# Altium project FIT_PM12_v1.1.PrjPcb (part 11 of 13)

## Sheet Gate_Strobe.SchDoc: FIT_PM12 board
size 420 x 297 mm; CheckedBy: G.Kasprowicz; Author: INR Moscow; CompanyName: WUT ISE; DrawnBy: M.Podgórski; Organization: WUT ISE; Address1: PW ISE; Address2: Nowowiejska 15/19 00-665 Warsaw; Address3: gkasprow@gmail.com; DocumentNumber: 5; Revision: 2; SheetNumber: 12; SheetTotal: 34; ModifiedBy: -; CheckedDate: -; Title2: INT gate strobe; DivGrp: WUT ISE; Designer: INR RAS; ModifiedDate: -; ProjectName: Sensor Box
Used 12 times, as channels AFE/Gate_Strobe1, AFE/Gate_Strobe2, AFE/Gate_Strobe3, AFE/Gate_Strobe4, AFE/Gate_Strobe5, AFE/Gate_Strobe6, AFE/Gate_Strobe7, AFE/Gate_Strobe8, AFE/Gate_Strobe9, AFE/Gate_Strobe10, AFE/Gate_Strobe11, AFE/Gate_Strobe12. Parts and nets are listed once, with the designators drawn on the sheet.
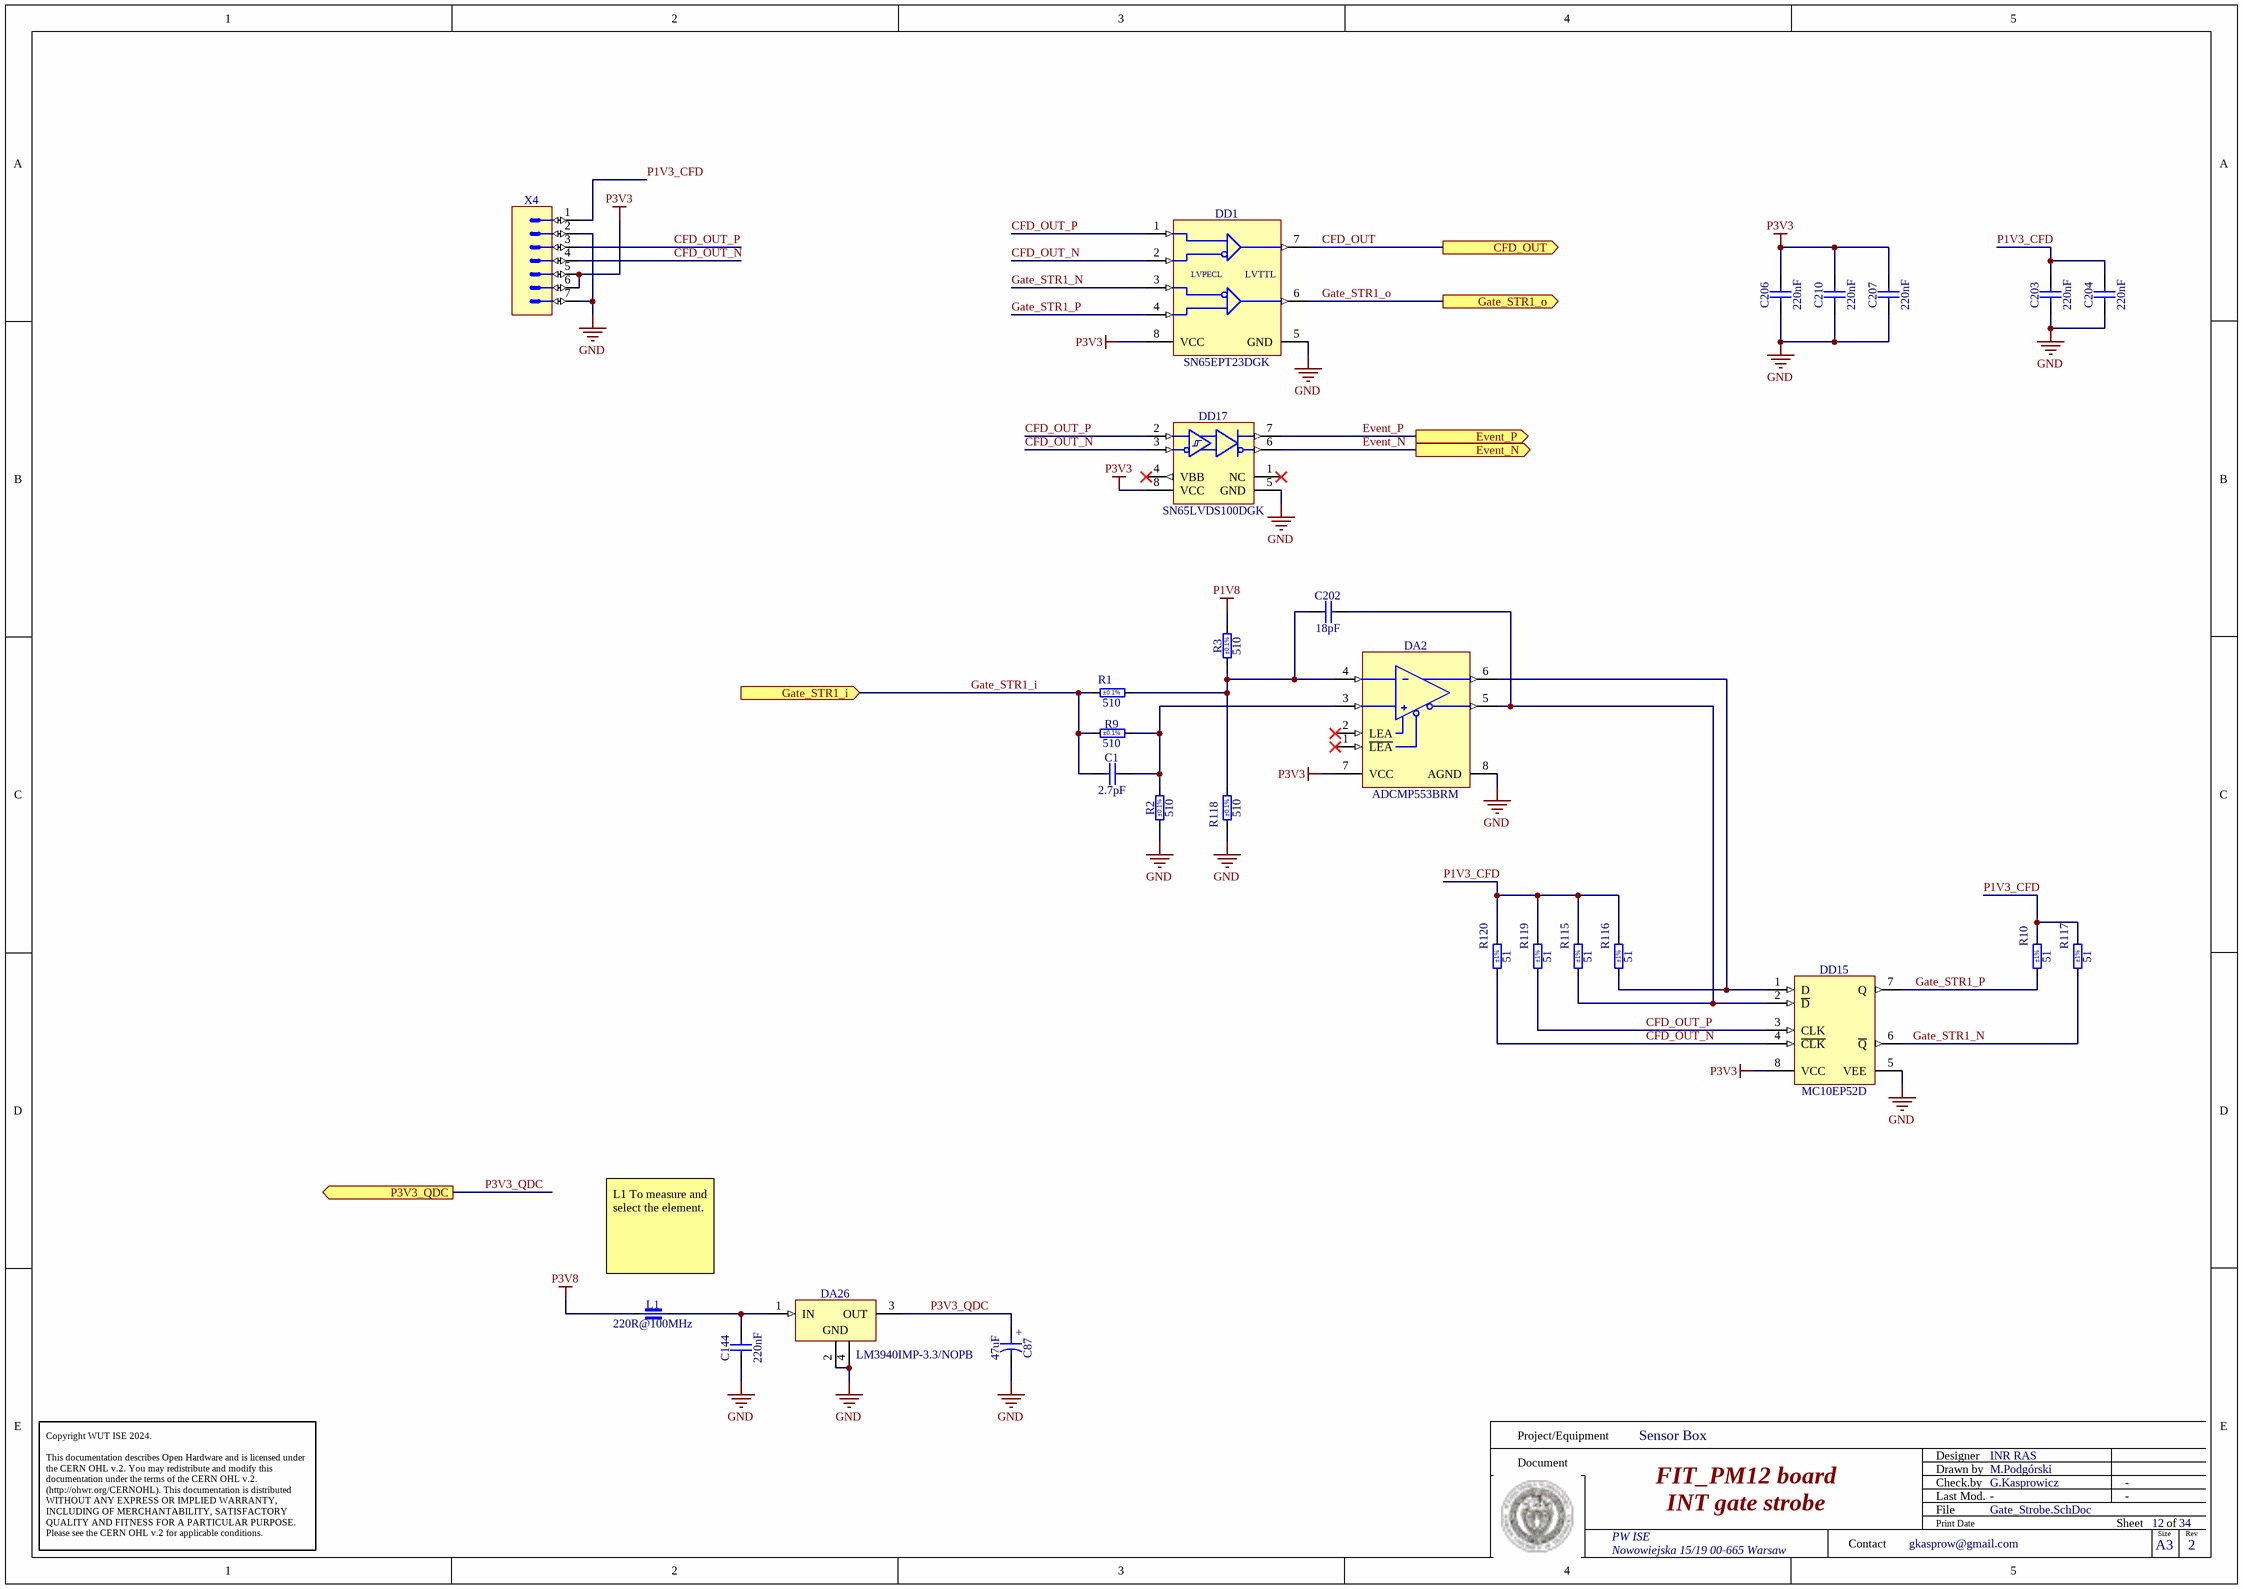
[diagram p33: Gate_Strobe.SchDoc]

### Parts
C1  2.7pF  [CAPC2012X135N]
C87  47uF  [CAPAE530X610N]
C144  220nF  [CAPC2012X135N]
C202  18pF  [CAPC2012X88N]
C203  220nF  [CAPC2012X135N]
C204  220nF  [CAPC2012X135N]
C206  220nF  [CAPC2012X135N]
C207  220nF  [CAPC2012X135N]
C210  220nF  [CAPC2012X135N]
DA2  ADCMP553BRM  [SOP65P490X110-8N]
DA26  LM3940IMP-3.3/NOPB  [SOT230P700X180-4N]
DD1  SN65EPT23DGK  [SOP65P490X110-8N]
DD15  MC10EP52D  [SOIC127P600X175-8N]
DD17  SN65LVDS100DGK  [SOP65P490X110-8N]
L1  220R@100MHz  [INDC2012X105N]
R1  510  Tolerance: ±0.1%  [RESC2012X60N]
R2  510  Tolerance: ±0.1%  [RESC2012X60N]
R3  510  Tolerance: ±0.1%  [RESC2012X60N]
R9  510  Tolerance: ±0.1%  [RESC2012X60N]
R10  51  Tolerance: ±1%  [RESC2012X60N]
R115  51  Tolerance: ±1%  [RESC2012X60N]
R116  51  Tolerance: ±1%  [RESC2012X60N]
R117  51  Tolerance: ±1%  [RESC2012X60N]
R118  510  Tolerance: ±0.1%  [RESC2012X60N]
R119  51  Tolerance: ±1%  [RESC2012X60N]
R120  51  Tolerance: ±1%  [RESC2012X60N]
X4  Header 7  [SAMTEC_DW-07-09-L-S-470]  (value not drawn)

### Ports
CFD_OUT (out), Event_N (out), Event_P (out), Gate_STR1_i (in), Gate_STR1_o (out), P3V3_QDC (out)

### Nets
GND: C87.2 C144.1 C203.1 C204.1 C206.1 C207.1 C210.1 DA2.8(AGND) DA26.2(GND) DA26.4(GND) DD1.5(GND) DD15.5(VEE) DD17.5(GND) R2.1 R118.1 X4.2 X4.7
P1V8: R3.2
P3V3: C206.2 C207.2 C210.2 DA2.7(VCC) DD1.8(VCC) DD15.8(VCC) DD17.8(VCC) X4.5 X4.6
P3V8: L1.1
CFD_OUT: DD1.7(Q0) ; port CFD_OUT
CFD_OUT_N: DD1.2(~{D0}) DD15.4(~{CLK}) DD17.3(B) R120.1 X4.4
CFD_OUT_P: DD1.1(D0) DD15.3(CLK) DD17.2(A) R119.1 X4.3
Event_N: DD17.6(Z) ; port Event_N
Event_P: DD17.7(Y) ; port Event_P
Gate_STR1_i: C1.1 R1.1 R9.1 ; port Gate_STR1_i
Gate_STR1_N: DD1.3(~{D1}) DD15.6(~{Q}) R117.1
Gate_STR1_o: DD1.6(Q1) ; port Gate_STR1_o
Gate_STR1_P: DD1.4(D1) DD15.7(Q) R10.1
P1V3_CFD: C203.2 C204.2 R10.2 R115.2 R116.2 R117.2 R119.2 R120.2 X4.1
P3V3_QDC: C87.1 DA26.3(OUT) ; port P3V3_QDC
NetC1_2: C1.2 DA2.3(+INA) R2.2 R9.2
NetC144_2: C144.2 DA26.1(IN) L1.2
NetC202_1: C202.1 DA2.4(-INA) R1.2 R3.1 R118.2
NetC202_2: C202.2 DA2.5(~{QA}) DD15.2(~{D}) R115.1
NetDA2_6: DA2.6(QA) DD15.1(D) R116.1

Not connected (* = marked no-connect by the designer): DA2 1(~{LEA})* 2(LEA)*; DD17 1(NC)* 4(VBB)*

### Channels
AFE/Gate_Strobe1: designators end in A; ports CFD_OUT=CFD_OUT Event_N=Event_N Event_P=Event_P Gate_STR1_i=Gate_STR1_i Gate_STR1_o=Gate_STR1_o P3V3_QDC=P3V3_QDC
AFE/Gate_Strobe2: designators end in B; ports CFD_OUT=CFD_OUT Event_N=Event_N Event_P=Event_P Gate_STR1_i=Gate_STR1_i Gate_STR1_o=Gate_STR1_o P3V3_QDC=P3V3_QDC
AFE/Gate_Strobe3: designators end in C; ports CFD_OUT=CFD_OUT Event_N=Event_N Event_P=Event_P Gate_STR1_i=Gate_STR1_i Gate_STR1_o=Gate_STR1_o P3V3_QDC=P3V3_QDC
AFE/Gate_Strobe4: designators end in D; ports CFD_OUT=CFD_OUT Event_N=Event_N Event_P=Event_P Gate_STR1_i=Gate_STR1_i Gate_STR1_o=Gate_STR1_o P3V3_QDC=P3V3_QDC
AFE/Gate_Strobe5: designators end in E; ports CFD_OUT=CFD_OUT Event_N=Event_N Event_P=Event_P Gate_STR1_i=Gate_STR1_i Gate_STR1_o=Gate_STR1_o P3V3_QDC=P3V3_QDC
AFE/Gate_Strobe6: designators end in F; ports CFD_OUT=CFD_OUT Event_N=Event_N Event_P=Event_P Gate_STR1_i=Gate_STR1_i Gate_STR1_o=Gate_STR1_o P3V3_QDC=P3V3_QDC
AFE/Gate_Strobe7: designators end in G; ports CFD_OUT=CFD_OUT Event_N=Event_N Event_P=Event_P Gate_STR1_i=Gate_STR1_i Gate_STR1_o=Gate_STR1_o P3V3_QDC=P3V3_QDC
AFE/Gate_Strobe8: designators end in H; ports CFD_OUT=CFD_OUT Event_N=Event_N Event_P=Event_P Gate_STR1_i=Gate_STR1_i Gate_STR1_o=Gate_STR1_o P3V3_QDC=P3V3_QDC
AFE/Gate_Strobe9: designators end in I; ports CFD_OUT=CFD_OUT Event_N=Event_N Event_P=Event_P Gate_STR1_i=Gate_STR1_i Gate_STR1_o=Gate_STR1_o P3V3_QDC=P3V3_QDC
AFE/Gate_Strobe10: designators end in J; ports CFD_OUT=CFD_OUT Event_N=Event_N Event_P=Event_P Gate_STR1_i=Gate_STR1_i Gate_STR1_o=Gate_STR1_o P3V3_QDC=P3V3_QDC
AFE/Gate_Strobe11: designators end in K; ports CFD_OUT=CFD_OUT Event_N=Event_N Event_P=Event_P Gate_STR1_i=Gate_STR1_i Gate_STR1_o=Gate_STR1_o P3V3_QDC=P3V3_QDC
AFE/Gate_Strobe12: designators end in L; ports CFD_OUT=CFD_OUT Event_N=Event_N Event_P=Event_P Gate_STR1_i=Gate_STR1_i Gate_STR1_o=Gate_STR1_o P3V3_QDC=P3V3_QDC

### Notes on the sheet
- (near L1) L1 To measure and select the element.
- Project/Equipment
- Document
- Designer
- Drawn by
- Check.by
- Copyright WUT ISE 2024.
  This documentation describes Open Hardware and is licensed under the CERN OHL v.2. You may redistribute and modify this documentation under the terms of the CERN OHL v.2. (http://ohwr.org/CERNOHL). This documentation is distributed WITHOUT ANY EXPRESS OR IMPLIED WARRANTY, INCLUDING OF MERCHANTABILITY, SATISFACTORY QUALITY AND FITNESS FOR A PARTICULAR PURPOSE. Please see the CERN OHL v.2 for applicable conditions.
- Contact
- File
- Last Mod.
- Print Date
- Sheet
- Size
- A3
- of
- Rev
- (in symbol CAE530-610_47UF_16V_20%) +
- (in symbol SN65EPT23DGK) LVPECL; LVTTL

### Library data of the parts
C1 = CC0805_2.7PF_250V_0.05PF_NP0: Non-polarised capacitor; Part Description: SMD Multilayer Chip Ceramic Capacitor; Manufacturer: GENERIC; Manufacturer1 Part Number: 600F2R7AT250XT; Voltage: 50V; TC: C0G/NP0; Tolerance: ±0.05pF; Part Number: CC0805_2.7PF_250V_0.05PF_NP0; Component Kind: Standard; Component Type: Standard; Pin Count: 2; Value: 2.7pF; Status: None; Manufacturer Part Number: CC0805_2.7PF_250V_0.05PF_NP0; Case: 0805; Mounted: Yes; Socket: No; SMD: Yes; Sense: No; Manufacturer1 Example: AVX; Manufacturer1 ComponentHeight: 1.30mm; HelpURL: \\cern.ch\dfs\Applications\Altium\Datasheets\CC0805_NP0_AVX(MLC).pdf; Author: CERN DEM HF; CreateDate: 07.05.2024; LatestRevisionDate: 07.05.2024
C87 = CAE530-610_47UF_16V_20%: Polarised capacitor; Part Description: Conductive Polymer Hybrid Aluminum Electrolytic Capacitor; Manufacturer: CHEMI-CON; Manufacturer Part Number: HHXD160ARA470ME61G; Voltage: 16V; Tolerance: ±20%; Part Number: CAE530-610_47UF_16V_20%; Component Kind: Standard; Component Type: Standard; Pin Count: 2; Value: 47uF; Status: Not Recommended; Case: C; Mounted: Yes; Socket: No; SMD: Yes; Sense: No; ComponentHeight: 6.1mm; HelpURL: \\cern.ch\dfs\Applications\Altium\Datasheets\CAE_CHIMI-CON_HXD.pdf; Author: CERN DEM HF; CreateDate: 15.04.2024; LatestRevisionDate: 15.04.2024
C144 C203 C204 C206 C207 C210 = CC0805_220NF_50V_10%_X7R: as C68 on sheet XC2C128; Part Number: CC0805_220NF_50V_10%_X7R; Component Kind: Standard; Component Type: Standard; Pin Count: 2; Value: 220nF; Status: Preferred; Manufacturer Part Number: CC0805_220NF_50V_10%_X7R; Case: 0805; Mounted: Yes; Socket: No; SMD: Yes; Sense: No; Manufacturer1 Example: MURATA; Manufacturer1 ComponentHeight: 1.35mm; HelpURL: \\cern.ch\dfs\Applications\Altium\Datasheets\CC0805_X7R_MURATA.pdf; Author: CERN DEM JLC; CreateDate: 03.12.2007; LatestRevisionDate: 03.12.2007
C202 = CC0805_18PF_50V_1%_C0G: Non-polarised capacitor; Part Description: SMD Multilayer Chip Ceramic Capacitor; Manufacturer: GENERIC; Manufacturer1 Part Number: C0805C180F5GACTU; Voltage: 50V; TC: C0G/NP0; Tolerance: ±1%; Part Number: CC0805_18PF_50V_1%_C0G; Component Kind: Standard; Component Type: Standard; Pin Count: 2; Value: 18pF; Status: None; Manufacturer Part Number: CC0805_18PF_50V_1%_C0G; Case: 0805; Mounted: Yes; Socket: No; SMD: Yes; Sense: No; Manufacturer1 Example: KEMET; Manufacturer1 ComponentHeight: 0.88mm; HelpURL: \\cern.ch\dfs\Applications\Altium\Datasheets\CC0805_C0G_KEMET_(Commercial Grade).pdf; Author: CERN DEM JLC; CreateDate: 27.01.2015; LatestRevisionDate: 27.01.2015
DA2 = ADCMP553BRM: Single-Supply, High Speed PECL/LVPECL Comparators; Part Description: Single-Supply, High Speed, PECL/LVPECL Comparators; Manufacturer: ANALOG DEVICES; PressFit: No; Bonding: No; Part Number: ADCMP553BRM; Component Kind: Standard; Component Type: Standard; Device: ADCMP553BRM; PackageDescription: SOP, 0.65mm Pitch; 8 Pin, 3.00mm W X 3.00mm L X 1.10mm H body, IPC Medium Density; Manufacturer Part Number: ADCMP553BRM; Pin Count: 8; Case: MSOP8; Mounted: Yes; Socket: No; SMD: Yes; Sense: No; ComponentHeight: 1.1mm; Author: CERN DEM HF; HelpURL: \\cern.ch\dfs\Applications\Altium\Datasheets\ADCMP553.pdf; CreateDate: 06.05.2024; LatestRevisionDate: 06.05.2024
DA26 = LM3940IMP-3.3/NOPB: 3-Terminal Regulator 1=IN 2=GND 3=OUT 4=GND; Part Description: 1A Low Dropout Regulator for 5V to 3.3V Conversion; Manufacturer: TEXAS INSTRUMENTS; PressFit: No; Bonding: No; Part Number: LM3940IMP-3.3/NOPB; Component Kind: Standard; Component Type: Standard; Device: LM3940IMP-3.3/NOPB; PackageDescription: SOT223, 2.30mm Pitch; 4 Pin, 3.70mm W X 6.70mm L X 1.80mm H body, IPC Medium Density; Manufacturer Part Number: LM3940IMP-3.3; Pin Count: 4; Case: SOT223; Mounted: Yes; Socket: No; SMD: Yes; Sense: No; ComponentHeight: 1.8mm; HelpURL: \\cern.ch\dfs\Applications\Altium\Datasheets\LM3940IMP-3.3-NOPB.pdf; Author: CERN DEM JLC; CreateDate: 28.03.2011; LatestRevisionDate: 01.06.2022
DD1 = SN65EPT23DGK: 5V PECL to TTL Translator; Part Description: 3.3V ECL Differential LVPECL/LVDS to LVTTL/LVCMOS Translator; Manufacturer: TEXAS INSTRUMENTS; PressFit: No; Bonding: No; Part Number: SN65EPT23DGK; Component Kind: Standard; Component Type: Standard; Device: SN65EPT23DGK; PackageDescription: SOP, 0.65mm Pitch; 8 Pin, 3.00mm W X 3.00mm L X 1.10mm H body, IPC Medium Density; Manufacturer Part Number: SN65EPT23DGK; Pin Count: 8; Case: TSSOP8; Mounted: Yes; Socket: No; SMD: Yes; Sense: No; ComponentHeight: 1.1mm; Author: CERN DEM HF; HelpURL: \\cern.ch\dfs\Applications\Altium\Datasheets\SN65EPT23.pdf; CreateDate: 17.05.2024; LatestRevisionDate: 17.05.2024
DD15 = MC10EP52D: 3.3V/5V ECL Differential Data and Clock D Flip-Flop; Manufacturer: ON SEMICONDUCTOR; PressFit: No; Bonding: No; Part Number: MC10EP52D; Component Kind: Standard; Component Type: Standard; Device: MC10EP52D; PackageDescription: SOIC 8, Pitch 1.27mm - Body 4x5mm, IPC Medium Density; Part Description: 3.3V/5V ECL Differential Data and Clock D Flip-Flop; Manufacturer Part Number: MC10EP52D; Pin Count: 8; Case: SOIC8; Mounted: Yes; Socket: No; SMD: Yes; Sense: No; ComponentHeight: 1.75mm; Author: CERN DEM HF; HelpURL: \\cern.ch\dfs\Applications\Altium\Datasheets\MC10EP52D.pdf; CreateDate: 08.05.2024; LatestRevisionDate: 08.05.2024
DD17 = SN65LVDS100DGK: Differential LVDS Translator/Repeater; Part Description: 2Gbps Differential LVDS Translator/Repeater; Manufacturer: TEXAS INSTRUMENTS; PressFit: No; Bonding: No; Part Number: SN65LVDS100DGK; Component Kind: Standard; Component Type: Standard; Device: SN65LVDS100DGK; PackageDescription: SOP, 0.65mm Pitch; 8 Pin, 3.00mm W X 3.00mm L X 1.10mm H body, IPC Medium Density; Manufacturer Part Number: SN65LVDS100DGK; Pin Count: 8; Case: SSOP8; Mounted: Yes; Socket: No; SMD: Yes; Sense: No; ComponentHeight: 1.1mm; Author: CERN DEM JLC; HelpURL: \\cern.ch\dfs\Applications\Altium\Datasheets\SN65LVDS100DGK.pdf; CreateDate: 18.11.2011; LatestRevisionDate: 18.11.2011
L1 = IND0805_TDK_MPZ2012S221A: Part Description: SMT Chip Bead for General Power Line (MPZ Series); Manufacturer: TDK; Power: 3A; Resistance: 0.04R; Tolerance: ±25%; Part Number: IND0805_TDK_MPZ2012S221A; Component Kind: Standard; Component Type: Standard; Pin Count: 2; Value: 220R@100MHz; Manufacturer Part Number: MPZ2012S221A; Case: 0805; Mounted: Yes; Socket: No; SMD: Yes; Sense: No; ComponentHeight: 1.05mm; HelpURL: \\cern.ch\dfs\Applications\Altium\Datasheets\IND0805_TDK_MPZ2012.pdf; Author: CERN DEM HF; CreateDate: 04.10.2021; LatestRevisionDate: 04.10.2021
R1-R3 R9 R118 = R0805_510R_0.1%_0.125W_10PPM: Resistor - 0.1%; Part Description: Thin Film Chip Resistor; Manufacturer: GENERIC; Manufacturer1 Part Number: RT0805BRB07510RL; Power: 0.125W; TC: ±10ppm; PressFit: No; Part Number: R0805_510R_0.1%_0.125W_10PPM; Component Kind: Standard; Component Type: Standard; Pin Count: 2; Value: 510; Status: Not Recommended; Manufacturer Part Number: R0805_510R_0.1%_0.125W_10PPM; Case: 0805; Mounted: Yes; Sense: No; Socket: No; SMD: Yes; Manufacturer1 Example: YAGEO PHYCOMP; Manufacturer1 ComponentHeight: 0.6mm; HelpURL: \\cern.ch\dfs\Applications\Altium\Datasheets\R0805_YAGEO_RT.pdf; Author: CERN DEM HF; CreateDate: 11.07.2022; LatestRevisionDate: 11.07.2022
R10 R115-R117 R119 R120 = R0805_51R_1%_0.125W_100PPM: Resistor - 1%; Part Description: General Purpose Thick Film Chip Resistor; Manufacturer: GENERIC; Manufacturer1 Part Number: NRC10F51R0TRF; Power: 0.125W; TC: ±100ppm/°C; PressFit: No; Part Number: R0805_51R_1%_0.125W_100PPM; Component Kind: Standard; Component Type: Standard; Pin Count: 2; Value: 51; Status: Preferred; Manufacturer Part Number: R0805_51R_1%_0.125W_100PPM; Case: 0805; Mounted: Yes; Sense: No; Socket: No; SMD: Yes; Manufacturer1 Example: NIC COMPONENT; Manufacturer1 ComponentHeight: 0.6mm; HelpURL: \\cern.ch\dfs\Applications\Altium\Datasheets\R0805_NIC_NRC.pdf; Author: CERN DEM JLC; CreateDate: 03.12.2007; LatestRevisionDate: 13.03.2008
X4 = SAMTEC_DW-07-09-L-S-470: Connector 7 Male; Part Description: 7 Contacts, Pitch 2.54mm, Single Row Straight .Flex Stack, Flexible Board Stacker (Stacker Height = 11,938mm); Manufacturer: SAMTEC; PressFit: No; Part Number: SAMTEC_DW-07-09-L-S-470; Component Kind: Standard; Component Type: Standard; Pin Count: 7; Family: Header 7; Mounted: Yes; Socket: No; SMD: No; Sense: No; Status: None; Manufacturer Part Number: DW-07-09-L-S-470; ComponentHeight: 15.75mm; HelpURL: \\cern.ch\dfs\Applications\Altium\Datasheets\SAMTEC_DW.pdf; Author: CERN DEM HF; CreateDate: 06.06.2024; LatestRevisionDate: 06.06.2024

## Sheet I2C_Switch.SchDoc: I2C switch
size 420 x 297 mm; CheckedBy: G.Kasprowicz; Author: INR Moscow; CompanyName: WUT ISE; DrawnBy: G.Kasprowicz; Organization: WUT ISE; Address1: PW ISE; Address2: Nowowiejska 15/19 00-665 Warsaw; Address3: gkasprow@gmail.com; DocumentNumber: 10; Revision: 2; SheetNumber: 35; SheetTotal: 35; ModifiedBy: -; CheckedDate: -; DivGrp: WUT ISE; Designer: GK; ModifiedDate: -; ProjectName: Sensor Box
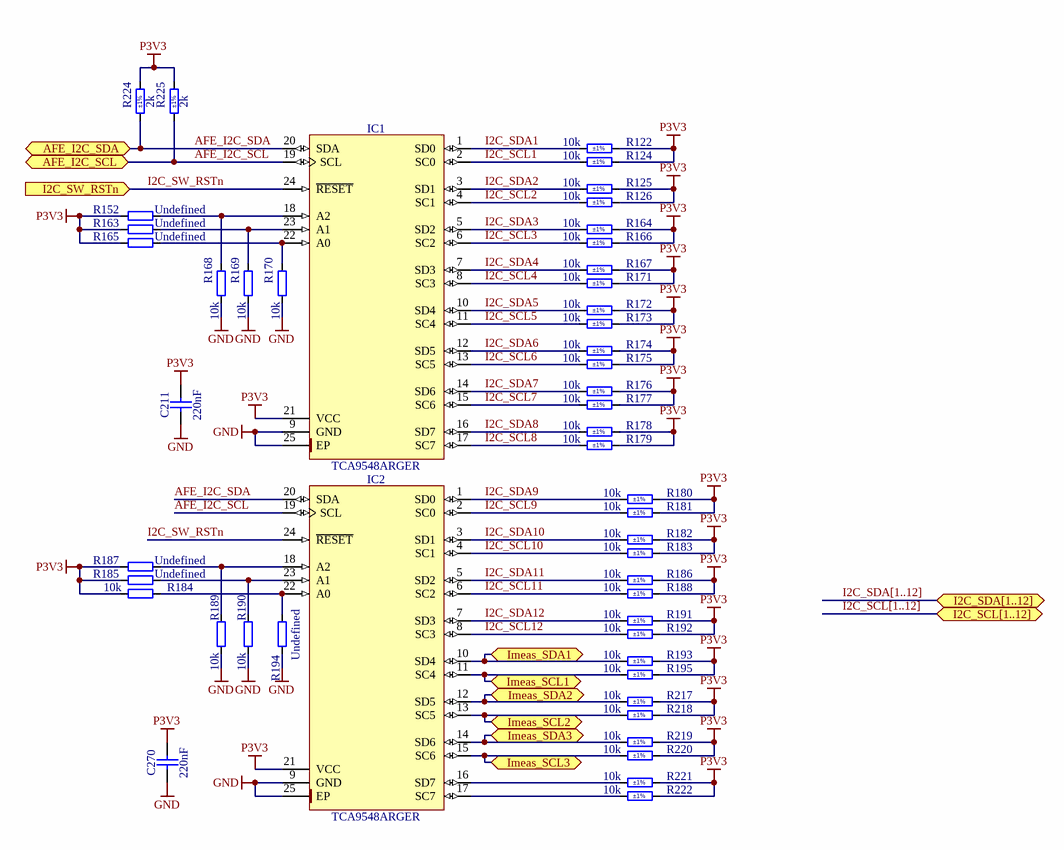
[diagram p34: I2C_Switch.SchDoc]

### Parts
(Parts that share a designator on the sheet are numbered #1, #2 ... from top to bottom, then left to right.)
C211#2  220nF  [CAPC1005X55N]
C270  220nF  [CAPC1005X55N]
IC1  TCA9548ARGER  [QFN50P400X400X100-25N-S220]
IC2  TCA9548ARGER  [QFN50P400X400X100-25N-S220]
R122  10k  Tolerance: ±1%  [RESC2012X60N]
R124#2  10k  Tolerance: ±1%  [RESC2012X60N]
R125#2  10k  Tolerance: ±1%  [RESC2012X60N]
R126#2  10k  Tolerance: ±1%  [RESC2012X60N]
R152#2  Undefined  [RESC1608X55N]
R163#2  Undefined  [RESC1608X55N]
R164  10k  Tolerance: ±1%  [RESC2012X60N]
R165  Undefined  [RESC1608X55N]
R166  10k  Tolerance: ±1%  [RESC2012X60N]
R167  10k  Tolerance: ±1%  [RESC2012X60N]
R168  10k  [RESC2012X60N]
R169  10k  [RESC2012X60N]
R170  10k  [RESC2012X60N]
R171  10k  Tolerance: ±1%  [RESC2012X60N]
R172  10k  Tolerance: ±1%  [RESC2012X60N]
R173  10k  Tolerance: ±1%  [RESC2012X60N]
R174  10k  Tolerance: ±1%  [RESC2012X60N]
R175  10k  Tolerance: ±1%  [RESC2012X60N]
R176  10k  Tolerance: ±1%  [RESC2012X60N]
R177  10k  Tolerance: ±1%  [RESC2012X60N]
R178  10k  Tolerance: ±1%  [RESC2012X60N]
R179  10k  Tolerance: ±1%  [RESC2012X60N]
R180  10k  Tolerance: ±1%  [RESC2012X60N]
R181  10k  Tolerance: ±1%  [RESC2012X60N]
R182  10k  Tolerance: ±1%  [RESC2012X60N]
R183  10k  Tolerance: ±1%  [RESC2012X60N]
R184  10k  [RESC2012X60N]
R185  Undefined  [RESC1608X55N]
R186  10k  Tolerance: ±1%  [RESC2012X60N]
R187  Undefined  [RESC1608X55N]
R188  10k  Tolerance: ±1%  [RESC2012X60N]
R189  10k  [RESC2012X60N]
R190  10k  [RESC2012X60N]
R191  10k  Tolerance: ±1%  [RESC2012X60N]
R192  10k  Tolerance: ±1%  [RESC2012X60N]
R193  10k  Tolerance: ±1%  [RESC2012X60N]
R194  Undefined  [RESC1608X55N]
R195  10k  Tolerance: ±1%  [RESC2012X60N]
R217  10k  Tolerance: ±1%  [RESC2012X60N]
R218  10k  Tolerance: ±1%  [RESC2012X60N]
R219  10k  Tolerance: ±1%  [RESC2012X60N]
R220  10k  Tolerance: ±1%  [RESC2012X60N]
R221  10k  Tolerance: ±1%  [RESC2012X60N]
R222  10k  Tolerance: ±1%  [RESC2012X60N]
R224  2k  Tolerance: ±1%  [RESC2012X60N]
R225  2k  Tolerance: ±1%  [RESC2012X60N]

### Ports
AFE_I2C_SCL (bidir), AFE_I2C_SDA (bidir), I2C_SCL[1..12] (bidir), I2C_SDA[1..12] (bidir), I2C_SW_RSTn (in), Imeas_SCL1 (bidir), Imeas_SCL2 (bidir), Imeas_SCL3 (bidir), Imeas_SDA1 (bidir), Imeas_SDA2 (bidir), Imeas_SDA3 (bidir)

### Nets
GND: C211#2.1 C270.1 IC1.9(GND) IC1.25(EP) IC2.9(GND) IC2.25(EP) R168.2 R169.2 R170.2 R189.2 R190.2 R194.1
P3V3: C211#2.2 C270.2 IC1.21(VCC) IC2.21(VCC) R122.1 R124#2.1 R125#2.1 R126#2.1 R152#2.1 R163#2.1 R164.1 R165.1 R166.1 R167.1 R171.1 R172.1 R173.1 R174.1 R175.1 R176.1 R177.1 R178.1 R179.1 R180.1 R181.1 R182.1 R183.1 R184.2 R185.1 R186.1 R187.1 R188.1 R191.1 R192.1 R193.1 R195.1 R217.1 R218.1 R219.1 R220.1 R221.1 R222.1 R224.2 R225.2
AFE_I2C_SCL: IC1.19(SCL) IC2.19(SCL) R225.1 ; port AFE_I2C_SCL
AFE_I2C_SDA: IC1.20(SDA) IC2.20(SDA) R224.1 ; port AFE_I2C_SDA
I2C_SCL1: IC1.2(SC0) R124#2.2
I2C_SCL2: IC1.4(SC1) R126#2.2
I2C_SCL3: IC1.6(SC2) R166.2
I2C_SCL4: IC1.8(SC3) R171.2
I2C_SCL5: IC1.11(SC4) R173.2
I2C_SCL6: IC1.13(SC5) R175.2
I2C_SCL7: IC1.15(SC6) R177.2
I2C_SCL8: IC1.17(SC7) R179.2
I2C_SCL9: IC2.2(SC0) R181.2
I2C_SCL10: IC2.4(SC1) R183.2
I2C_SCL11: IC2.6(SC2) R188.2
I2C_SCL12: IC2.8(SC3) R192.2
I2C_SDA1: IC1.1(SD0) R122.2
I2C_SDA2: IC1.3(SD1) R125#2.2
I2C_SDA3: IC1.5(SD2) R164.2
I2C_SDA4: IC1.7(SD3) R167.2
I2C_SDA5: IC1.10(SD4) R172.2
I2C_SDA6: IC1.12(SD5) R174.2
I2C_SDA7: IC1.14(SD6) R176.2
I2C_SDA8: IC1.16(SD7) R178.2
I2C_SDA9: IC2.1(SD0) R180.2
I2C_SDA10: IC2.3(SD1) R182.2
I2C_SDA11: IC2.5(SD2) R186.2
I2C_SDA12: IC2.7(SD3) R191.2
I2C_SW_RSTn: IC1.24(~{RESET}) IC2.24(~{RESET}) ; port I2C_SW_RSTn
NetIC1_18: IC1.18(A2) R152#2.2 R168.1
NetIC1_22: IC1.22(A0) R165.2 R170.1
NetIC1_23: IC1.23(A1) R163#2.2 R169.1
NetIC2_10: IC2.10(SD4) R193.2 ; port Imeas_SDA1
NetIC2_11: IC2.11(SC4) R195.2 ; port Imeas_SCL1
NetIC2_12: IC2.12(SD5) R217.2 ; port Imeas_SDA2
NetIC2_13: IC2.13(SC5) R218.2 ; port Imeas_SCL2
NetIC2_14: IC2.14(SD6) R219.2 ; port Imeas_SDA3
NetIC2_15: IC2.15(SC6) R220.2 ; port Imeas_SCL3
NetIC2_16: IC2.16(SD7) R221.2
NetIC2_17: IC2.17(SC7) R222.2
NetIC2_18: IC2.18(A2) R187.2 R189.1
NetIC2_22: IC2.22(A0) R184.1 R194.2
NetIC2_23: IC2.23(A1) R185.2 R190.1

### Buses and harness runs
bus I2C_SCL[1..12] = port I2C_SCL[1..12]
bus I2C_SDA[1..12] = port I2C_SDA[1..12]

### Notes on the sheet
- Project/Equipment
- Document
- Designer
- Drawn by
- Check.by
- Copyright WUT ISE 2024.
  This documentation describes Open Hardware and is licensed under the CERN OHL v.2. You may redistribute and modify this documentation under the terms of the CERN OHL v.2. (http://ohwr.org/CERNOHL). This documentation is distributed WITHOUT ANY EXPRESS OR IMPLIED WARRANTY, INCLUDING OF MERCHANTABILITY, SATISFACTORY QUALITY AND FITNESS FOR A PARTICULAR PURPOSE. Please see the CERN OHL v.2 for applicable conditions.
- Contact
- File
- Last Mod.
- Print Date
- Sheet
- Size
- A3
- of
- Rev

### Library data of the parts
C211#2 C270 = CC0402_220NF_35V_10%_X7R: Non-polarised capacitor; Part Description: SMD Multilayer Chip Ceramic Capacitor; Manufacturer: GENERIC; Manufacturer1 Part Number: CGA2B1X7R1V224K050; Voltage: 35V; TC: X7R; Tolerance: ±10%; Part Number: CC0402_220NF_35V_10%_X7R; Component Kind: Standard; Component Type: Standard; Pin Count: 2; Value: 220nF; Status: None; Manufacturer Part Number: CC0402_220NF_35V_10%_X7R; Case: 0402; Mounted: Yes; Socket: No; SMD: Yes; Sense: No; Manufacturer1 Example: TDK; Manufacturer1 ComponentHeight: 0.55mm; HelpURL: \\cern.ch\dfs\Applications\Altium\Datasheets\CC0402_X7R_TDK_CGA.pdf; Author: CERN DEM HF; CreateDate: 09.11.2023; LatestRevisionDate: 09.11.2023
IC1 IC2 = TCA9548ARGER: Low Voltage 8-Channel I2C Switch With Reset; Manufacturer: TEXAS INSTRUMENTS; PressFit: No; Bonding: No; Part Number: TCA9548ARGER; Component Kind: Standard; Component Type: Standard; Device: TCA9548ARGER; PackageDescription: QFN, 0.50mm Pitch, Square; 24 Pin, 4.00mm L X 4.00mm W X 1.00mm H body (w/Thermal Tab 2.20 X 2.20mm), IPC Medium Density; Part Description: Low Voltage 8-Channel I2C Switch with Reset; Manufacturer Part Number: TCA9548ARGE; Pin Count: 25; Case: QFN24; Mounted: Yes; Socket: No; SMD: Yes; Sense: No; ComponentHeight: 1mm; Author: CERN DEM JLC; HelpURL: \\cern.ch\dfs\Applications\Altium\Datasheets\TCA9548ARGER.pdf; CreateDate: 07.07.2014; LatestRevisionDate: 13.06.2022
R122 R124#2 R125#2 R126#2 R164 R166-R184 R186 R188-R193 R195 R217-R222 = R0805_10K_1%_0.125W_100PPM: Resistor - 1%; Part Description: General Purpose Thick Film Chip Resistor; Manufacturer: GENERIC; Manufacturer1 Part Number: NRC10F1002TRF; Power: 0.125W; TC: ±100ppm/°C; PressFit: No; Part Number: R0805_10K_1%_0.125W_100PPM; Component Kind: Standard; Component Type: Standard; Pin Count: 2; Value: 10k; Status: Preferred; Manufacturer Part Number: R0805_10K_1%_0.125W_100PPM; Case: 0805; Mounted: Yes; Sense: No; Socket: No; SMD: Yes; Manufacturer1 Example: NIC COMPONENT; Manufacturer1 ComponentHeight: 0.6mm; HelpURL: \\cern.ch\dfs\Applications\Altium\Datasheets\R0805_NIC_NRC.pdf; Author: CERN DEM JLC; CreateDate: 03.12.2007; LatestRevisionDate: 13.03.2008
R152#2 R163#2 R165 R185 R187 R194 = R0603_NO-VALUE: Resistor; Part Description: Reserved Footprint For a 0603 (1608) Chip Resistor; PressFit: No; Mounted: No; Part Number: R0603_NO-VALUE; Component Kind: Standard; Component Type: Standard; Pin Count: 2; Value: Undefined; Status: None; Manufacturer: Undefined; Manufacturer Part Number: R0603_NO-VALUE; Case: 0603; Sense: No; Socket: No; SMD: Yes; Manufacturer1 Example: Undefined; Manufacturer1 Part Number: Undefined; Manufacturer1 ComponentHeight: Undefined; HelpURL: Undefined; Author: CERN DEM JLC; CreateDate: 03.12.2007; LatestRevisionDate: 13.03.2008
R224 R225 = R0805_2K_1%_0.125W_100PPM: Resistor - 1%; Part Description: General Purpose Thick Film Chip Resistor; Manufacturer: GENERIC; Manufacturer1 Part Number: NRC10F2001TRF; Power: 0.125W; TC: ±100ppm/°C; PressFit: No; Part Number: R0805_2K_1%_0.125W_100PPM; Component Kind: Standard; Component Type: Standard; Pin Count: 2; Value: 2k; Status: Preferred; Manufacturer Part Number: R0805_2K_1%_0.125W_100PPM; Case: 0805; Mounted: Yes; Sense: No; Socket: No; SMD: Yes; Manufacturer1 Example: NIC COMPONENT; Manufacturer1 ComponentHeight: 0.6mm; HelpURL: \\cern.ch\dfs\Applications\Altium\Datasheets\R0805_NIC_NRC.pdf; Author: CERN DEM JLC; CreateDate: 03.12.2007; LatestRevisionDate: 13.03.2008